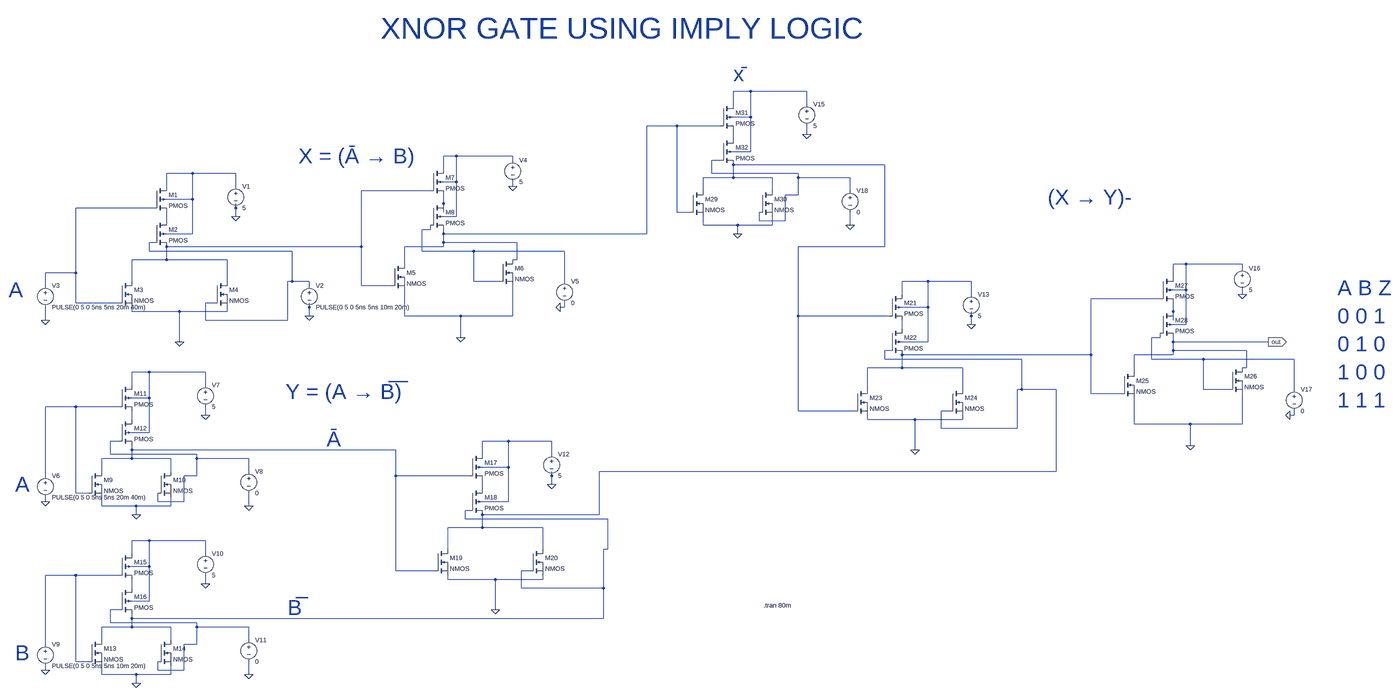
[diagram p0: schematic originalxnorgateimply.asc, whole sheet]
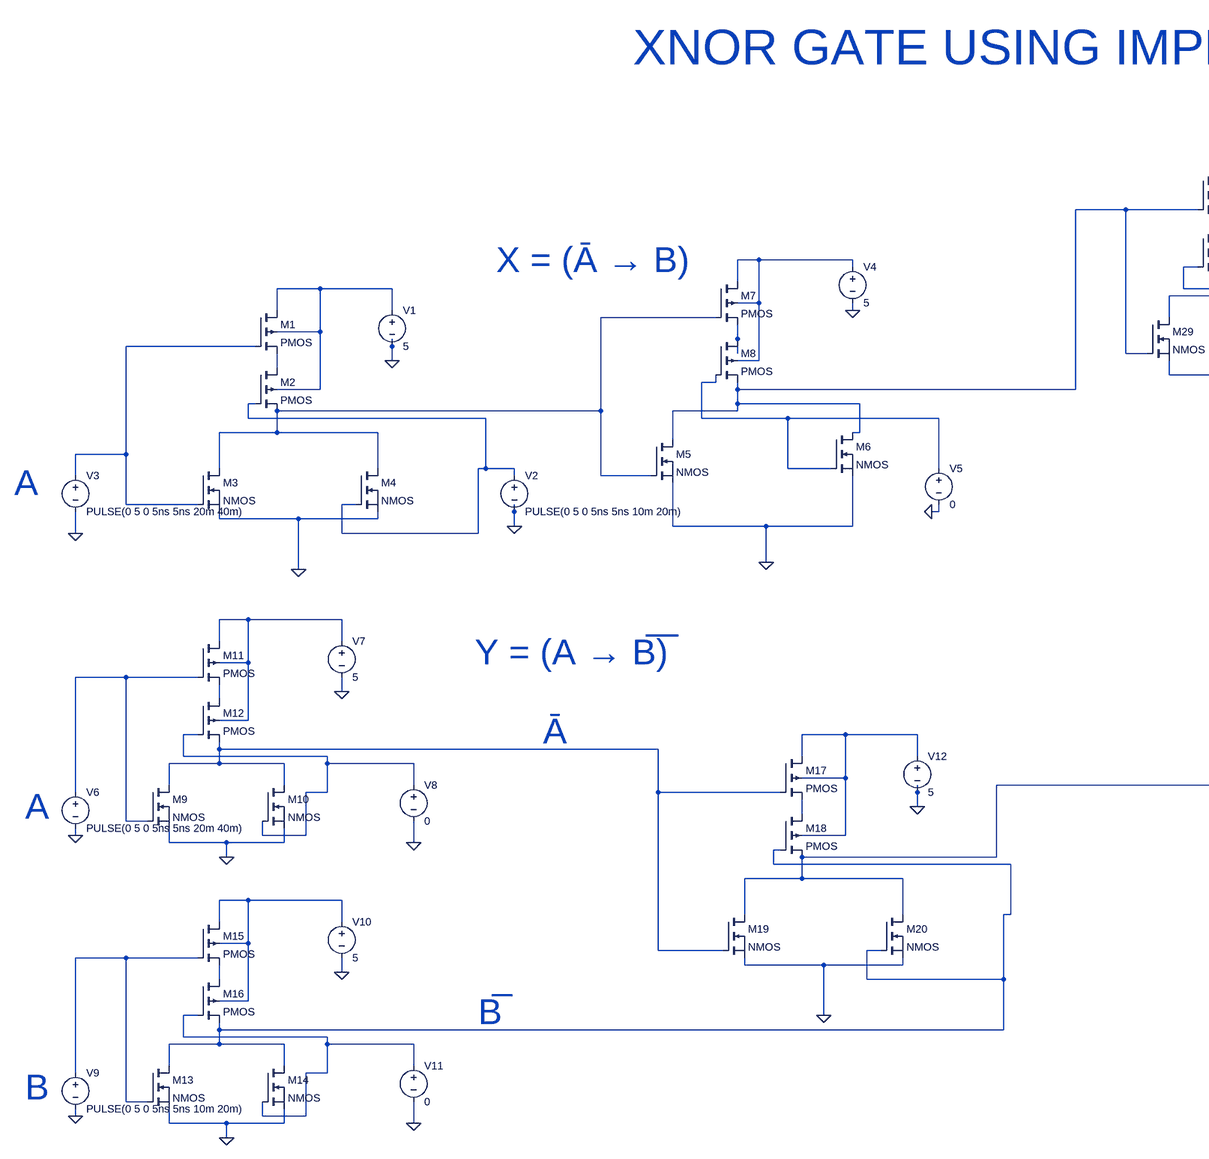
[diagram p1: schematic originalxnorgateimply.asc, part, row 1 of 1, column 1 of 2]
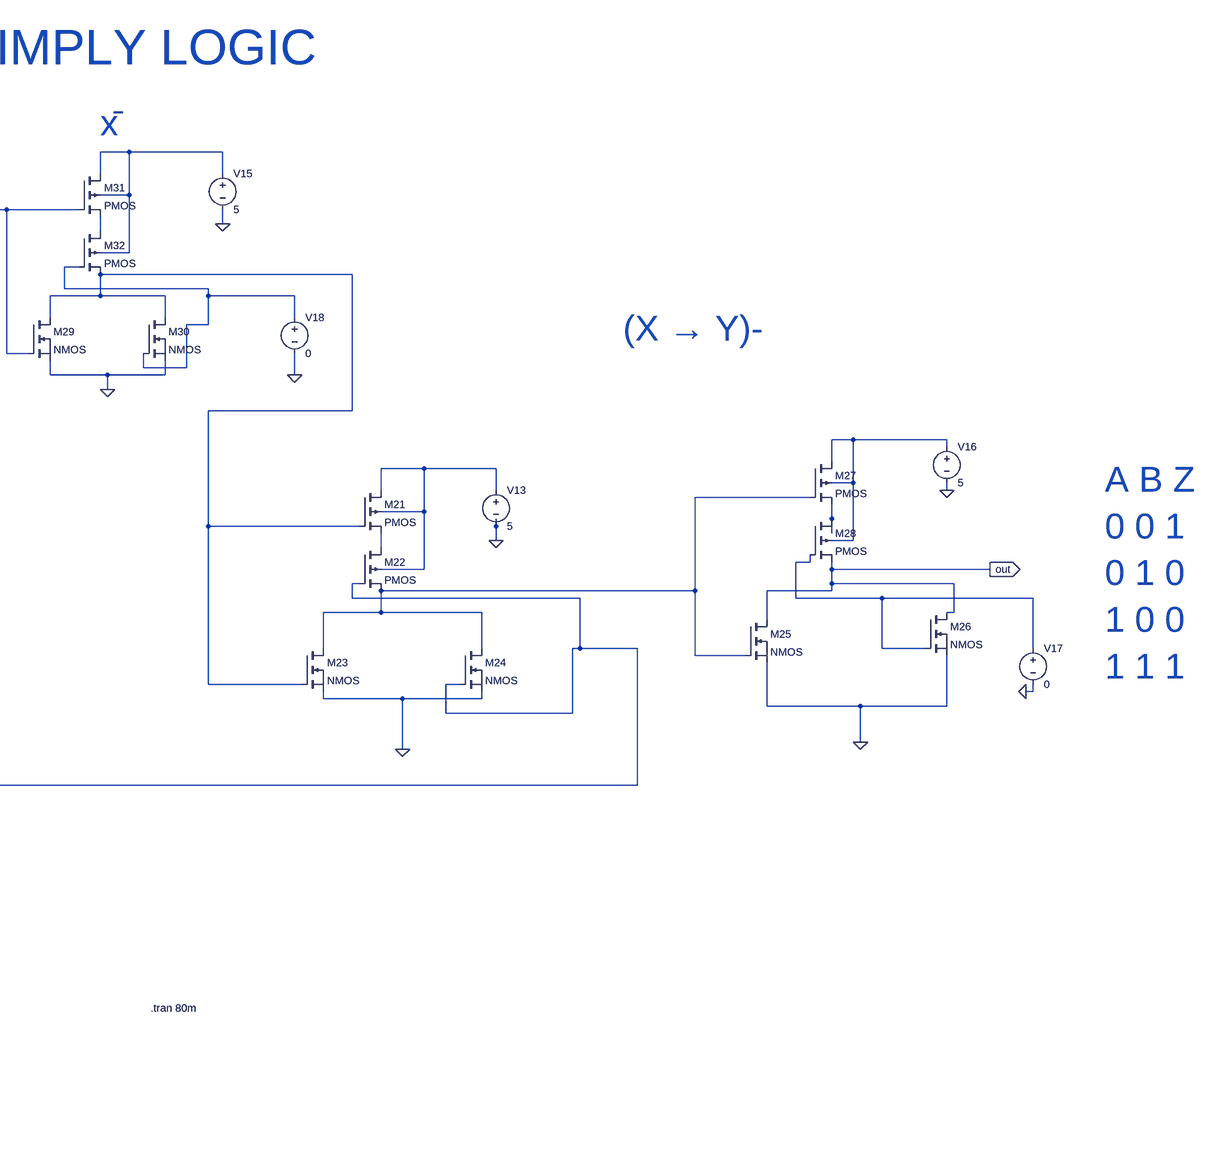
[diagram p2: schematic originalxnorgateimply.asc, part, row 1 of 1, column 2 of 2]
originalxnorgateimply.asc, the LTspice schematic file:
Version 4
SHEET 1 4060 1688
WIRE 1664 -592 1600 -592
WIRE 1872 -592 1664 -592
WIRE 1600 -544 1600 -592
WIRE 1872 -544 1872 -592
WIRE 1664 -496 1664 -592
WIRE 1664 -496 1600 -496
WIRE 1392 -464 1280 -464
WIRE 1552 -464 1392 -464
WIRE 1872 -432 1872 -464
WIRE 1600 -416 1600 -448
WIRE 1664 -368 1664 -496
WIRE 1664 -368 1600 -368
WIRE 576 -352 528 -352
WIRE 784 -352 576 -352
WIRE 784 -336 784 -352
WIRE 1552 -336 1520 -336
WIRE 2160 -320 1600 -320
WIRE 528 -304 528 -352
WIRE -400 -288 -496 -288
WIRE -240 -288 -400 -288
WIRE 1520 -288 1520 -336
WIRE 1840 -288 1520 -288
WIRE 1600 -272 1600 -320
WIRE 1600 -272 1488 -272
WIRE 1744 -272 1600 -272
WIRE 1840 -272 1840 -288
WIRE 2032 -272 1840 -272
WIRE 576 -256 576 -352
WIRE 576 -256 528 -256
WIRE -496 -240 -496 -288
WIRE -240 -240 -240 -288
WIRE 784 -240 784 -256
WIRE 480 -224 224 -224
WIRE 1488 -224 1488 -272
WIRE 1744 -224 1744 -272
WIRE 2032 -224 2032 -272
WIRE 1840 -208 1840 -272
WIRE 1840 -208 1792 -208
WIRE -400 -192 -400 -288
WIRE -400 -192 -496 -192
WIRE 528 -176 528 -208
WIRE -544 -160 -832 -160
WIRE -240 -160 -240 -176
WIRE 528 -144 528 -176
WIRE 1392 -144 1392 -464
WIRE 1440 -144 1392 -144
WIRE -240 -128 -240 -160
WIRE 576 -128 576 -256
WIRE 576 -128 528 -128
WIRE -496 -112 -496 -144
WIRE 1696 -112 1696 -144
WIRE 1792 -112 1792 -208
WIRE 1792 -112 1696 -112
WIRE 1488 -96 1488 -128
WIRE 1616 -96 1488 -96
WIRE 1744 -96 1744 -128
WIRE 1744 -96 1616 -96
WIRE 2032 -96 2032 -144
WIRE 480 -80 480 -96
WIRE 480 -80 448 -80
WIRE -400 -64 -400 -192
WIRE -400 -64 -496 -64
WIRE 528 -64 528 -80
WIRE 1280 -64 1280 -464
WIRE 1280 -64 528 -64
WIRE 1616 -64 1616 -96
WIRE -544 -32 -560 -32
WIRE 528 -32 528 -64
WIRE 800 -32 528 -32
WIRE 224 -16 224 -224
WIRE 224 -16 -496 -16
WIRE 528 -16 528 -32
WIRE 528 -16 384 -16
WIRE 2160 -16 2160 -320
WIRE 2160 -16 1840 -16
WIRE -560 0 -560 -32
WIRE -32 0 -560 0
WIRE 448 0 448 -80
WIRE 640 0 448 0
WIRE 976 0 640 0
WIRE -496 32 -496 -16
WIRE -496 32 -624 32
WIRE -272 32 -496 32
WIRE 800 32 800 -32
WIRE 800 32 784 32
WIRE 384 48 384 -16
WIRE 3296 48 3248 48
WIRE 3504 48 3296 48
WIRE 3504 64 3504 48
WIRE -832 80 -832 -160
WIRE -832 80 -944 80
WIRE 3248 96 3248 48
WIRE -624 112 -624 32
WIRE -272 112 -272 32
WIRE -32 112 -32 0
WIRE -32 112 -48 112
WIRE 32 112 -32 112
WIRE 640 112 640 0
WIRE 736 112 640 112
WIRE 976 112 976 0
WIRE 2320 112 2224 112
WIRE 2480 112 2320 112
WIRE -944 128 -944 80
WIRE 32 128 32 112
WIRE 224 128 224 -16
WIRE 336 128 224 128
WIRE 3296 144 3296 48
WIRE 3296 144 3248 144
WIRE 2224 160 2224 112
WIRE 2480 160 2480 112
WIRE 3504 160 3504 144
WIRE 3200 176 2944 176
WIRE -832 192 -832 80
WIRE -672 192 -832 192
WIRE -320 192 -352 192
WIRE 32 208 32 192
WIRE 976 208 976 192
WIRE 976 208 960 208
WIRE 2320 208 2320 112
WIRE 2320 208 2224 208
WIRE -624 224 -624 208
WIRE -448 224 -624 224
WIRE -272 224 -272 208
WIRE -272 224 -448 224
WIRE 3248 224 3248 192
WIRE 32 240 32 208
WIRE 384 240 384 144
WIRE 592 240 384 240
WIRE 784 240 784 128
WIRE 784 240 592 240
WIRE 1840 240 1840 -16
WIRE 2176 240 1840 240
WIRE 2480 240 2480 224
WIRE -944 256 -944 208
WIRE -352 256 -352 192
WIRE -48 256 -48 112
WIRE -48 256 -352 256
WIRE 3248 256 3248 224
WIRE 2480 272 2480 240
WIRE 3296 272 3296 144
WIRE 3296 272 3248 272
WIRE 2224 288 2224 256
WIRE 592 320 592 240
WIRE 3200 320 3200 304
WIRE 3200 320 3168 320
WIRE -448 336 -448 224
WIRE 2320 336 2320 208
WIRE 2320 336 2224 336
WIRE 3248 336 3248 320
WIRE 3600 336 3248 336
WIRE 2176 368 2160 368
WIRE 3248 368 3248 336
WIRE 3520 368 3248 368
WIRE 2944 384 2944 176
WIRE 2944 384 2224 384
WIRE 3248 384 3248 368
WIRE 3248 384 3104 384
WIRE 2160 400 2160 368
WIRE 2688 400 2160 400
WIRE 3168 400 3168 320
WIRE 3360 400 3168 400
WIRE 3696 400 3360 400
WIRE 2224 432 2224 384
WIRE 2224 432 2096 432
WIRE 2448 432 2224 432
WIRE 3520 432 3520 368
WIRE 3520 432 3504 432
WIRE -560 448 -624 448
WIRE -352 448 -560 448
WIRE 3104 448 3104 384
WIRE -624 496 -624 448
WIRE -352 496 -352 448
WIRE 2096 512 2096 432
WIRE 2448 512 2448 432
WIRE 2688 512 2688 400
WIRE 2688 512 2672 512
WIRE 2816 512 2688 512
WIRE 3360 512 3360 400
WIRE 3456 512 3360 512
WIRE 3696 512 3696 400
WIRE 2944 528 2944 384
WIRE 3056 528 2944 528
WIRE -560 544 -560 448
WIRE -560 544 -624 544
WIRE -832 576 -944 576
WIRE -672 576 -832 576
WIRE 1840 592 1840 240
WIRE 2048 592 1840 592
WIRE 2400 592 2368 592
WIRE -352 608 -352 576
WIRE 3696 608 3696 592
WIRE 3696 608 3680 608
WIRE -624 624 -624 592
WIRE 2096 624 2096 608
WIRE 2272 624 2096 624
WIRE 2448 624 2448 608
WIRE 2448 624 2272 624
WIRE 3104 640 3104 544
WIRE 3312 640 3104 640
WIRE 3504 640 3504 528
WIRE 3504 640 3312 640
WIRE 2368 656 2368 592
WIRE 2672 656 2672 512
WIRE 2672 656 2368 656
WIRE -560 672 -560 544
WIRE -560 672 -624 672
WIRE -672 704 -704 704
WIRE 768 704 672 704
WIRE 928 704 768 704
WIRE 3312 720 3312 640
WIRE -624 736 -624 720
WIRE 352 736 -624 736
WIRE 2272 736 2272 624
WIRE -704 752 -704 704
WIRE -384 752 -704 752
WIRE 672 752 672 704
WIRE 928 752 928 704
WIRE -624 768 -624 736
WIRE -624 768 -736 768
WIRE -480 768 -624 768
WIRE -384 768 -384 752
WIRE -192 768 -384 768
WIRE 768 800 768 704
WIRE 768 800 672 800
WIRE -736 816 -736 768
WIRE -480 816 -480 768
WIRE -192 816 -192 768
WIRE 2816 816 2816 512
WIRE 2816 816 1104 816
WIRE -944 832 -944 576
WIRE -384 832 -384 768
WIRE -384 832 -432 832
WIRE 352 832 352 736
WIRE 624 832 352 832
WIRE 928 832 928 816
WIRE 928 864 928 832
WIRE 672 880 672 848
WIRE -832 896 -832 576
WIRE -784 896 -832 896
WIRE -944 928 -944 912
WIRE -528 928 -528 896
WIRE -432 928 -432 832
WIRE -432 928 -528 928
WIRE 768 928 768 800
WIRE 768 928 672 928
WIRE -736 944 -736 912
WIRE -608 944 -736 944
WIRE -480 944 -480 912
WIRE -480 944 -608 944
WIRE -192 944 -192 896
WIRE 624 960 608 960
WIRE -608 976 -608 944
WIRE 1104 976 1104 816
WIRE 1104 976 672 976
WIRE 608 992 608 960
WIRE 1136 992 608 992
WIRE 672 1024 672 976
WIRE 672 1024 544 1024
WIRE 896 1024 672 1024
WIRE -560 1072 -624 1072
WIRE -352 1072 -560 1072
WIRE 544 1104 544 1024
WIRE 896 1104 896 1024
WIRE 1136 1104 1136 992
WIRE 1136 1104 1120 1104
WIRE -624 1120 -624 1072
WIRE -352 1120 -352 1072
WIRE -560 1168 -560 1072
WIRE -560 1168 -624 1168
WIRE 352 1184 352 832
WIRE 496 1184 352 1184
WIRE 848 1184 816 1184
WIRE -832 1200 -944 1200
WIRE -672 1200 -832 1200
WIRE 544 1216 544 1200
WIRE 720 1216 544 1216
WIRE 896 1216 896 1200
WIRE 896 1216 720 1216
WIRE -352 1232 -352 1200
WIRE -624 1248 -624 1216
WIRE 816 1248 816 1184
WIRE 1120 1248 1120 1104
WIRE 1120 1248 816 1248
WIRE -560 1296 -560 1168
WIRE -560 1296 -624 1296
WIRE -672 1328 -704 1328
WIRE 720 1328 720 1216
WIRE -624 1360 -624 1344
WIRE 1120 1360 1120 1248
WIRE 1120 1360 -624 1360
WIRE -704 1376 -704 1328
WIRE -384 1376 -704 1376
WIRE -624 1392 -624 1360
WIRE -624 1392 -736 1392
WIRE -480 1392 -624 1392
WIRE -384 1392 -384 1376
WIRE -192 1392 -384 1392
WIRE -736 1440 -736 1392
WIRE -480 1440 -480 1392
WIRE -192 1440 -192 1392
WIRE -944 1456 -944 1200
WIRE -384 1456 -384 1392
WIRE -384 1456 -432 1456
WIRE -832 1520 -832 1200
WIRE -784 1520 -832 1520
WIRE -944 1552 -944 1536
WIRE -528 1552 -528 1520
WIRE -432 1552 -432 1456
WIRE -432 1552 -528 1552
WIRE -736 1568 -736 1536
WIRE -608 1568 -736 1568
WIRE -480 1568 -480 1536
WIRE -480 1568 -608 1568
WIRE -192 1568 -192 1520
WIRE -608 1600 -608 1568
FLAG -944 256 0
FLAG -448 336 0
FLAG 32 240 0
FLAG -240 -128 0
FLAG 784 -240 0
FLAG 592 320 0
FLAG 960 208 0
FLAG -352 608 0
FLAG -608 976 0
FLAG -944 928 0
FLAG -192 944 0
FLAG -352 1232 0
FLAG -608 1600 0
FLAG -944 1552 0
FLAG -192 1568 0
FLAG 720 1328 0
FLAG 928 864 0
FLAG 2272 736 0
FLAG 2480 272 0
FLAG 3504 160 0
FLAG 3312 720 0
FLAG 3680 608 0
FLAG 3600 336 out
IOPIN 3600 336 Out
FLAG 1872 -432 0
FLAG 1616 -64 0
FLAG 2032 -96 0
SYMBOL pmos4 -544 -240 R0
SYMATTR InstName M1
SYMBOL pmos4 -544 -112 R0
SYMATTR InstName M2
SYMBOL nmos -672 112 R0
SYMATTR InstName M3
SYMBOL nmos -320 112 R0
SYMATTR InstName M4
SYMBOL voltage -240 -256 R0
WINDOW 123 0 0 Left 0
WINDOW 39 0 0 Left 0
SYMATTR InstName V1
SYMATTR Value 5
SYMBOL voltage 32 112 R0
WINDOW 123 0 0 Left 0
WINDOW 39 0 0 Left 0
SYMATTR InstName V2
SYMATTR Value PULSE(0 5 0 5ns 5ns 10m 20m)
SYMBOL voltage -944 112 R0
WINDOW 123 0 0 Left 0
WINDOW 39 0 0 Left 0
SYMATTR InstName V3
SYMATTR Value PULSE(0 5 0 5ns 5ns 20m 40m)
SYMBOL nmos 336 48 R0
SYMATTR InstName M5
SYMBOL nmos 736 32 R0
SYMATTR InstName M6
SYMBOL voltage 784 -352 R0
WINDOW 123 0 0 Left 0
WINDOW 39 0 0 Left 0
SYMATTR InstName V4
SYMATTR Value 5
SYMBOL voltage 976 96 R0
WINDOW 123 0 0 Left 0
WINDOW 39 0 0 Left 0
SYMATTR InstName V5
SYMATTR Value 0
SYMBOL pmos4 480 -304 R0
SYMATTR InstName M7
SYMBOL pmos4 480 -176 R0
SYMATTR InstName M8
SYMBOL nmos -784 816 R0
SYMATTR InstName M9
SYMBOL voltage -944 816 R0
WINDOW 123 0 0 Left 0
WINDOW 39 0 0 Left 0
SYMATTR InstName V6
SYMATTR Value PULSE(0 5 0 5ns 5ns 20m 40m)
SYMBOL voltage -352 480 R0
WINDOW 123 0 0 Left 0
WINDOW 39 0 0 Left 0
SYMATTR InstName V7
SYMATTR Value 5
SYMBOL voltage -192 800 R0
WINDOW 123 0 0 Left 0
WINDOW 39 0 0 Left 0
SYMATTR InstName V8
SYMATTR Value 0
SYMBOL nmos -528 816 R0
SYMATTR InstName M10
SYMBOL pmos4 -672 496 R0
SYMATTR InstName M11
SYMBOL pmos4 -672 624 R0
SYMATTR InstName M12
SYMBOL nmos -784 1440 R0
SYMATTR InstName M13
SYMBOL voltage -944 1440 R0
WINDOW 123 0 0 Left 0
WINDOW 39 0 0 Left 0
SYMATTR InstName V9
SYMATTR Value PULSE(0 5 0 5ns 5ns 10m 20m)
SYMBOL voltage -352 1104 R0
WINDOW 123 0 0 Left 0
WINDOW 39 0 0 Left 0
SYMATTR InstName V10
SYMATTR Value 5
SYMBOL voltage -192 1424 R0
WINDOW 123 0 0 Left 0
WINDOW 39 0 0 Left 0
SYMATTR InstName V11
SYMATTR Value 0
SYMBOL nmos -528 1440 R0
SYMATTR InstName M14
SYMBOL pmos4 -672 1120 R0
SYMATTR InstName M15
SYMBOL pmos4 -672 1248 R0
SYMATTR InstName M16
SYMBOL pmos4 624 752 R0
SYMATTR InstName M17
SYMBOL pmos4 624 880 R0
SYMATTR InstName M18
SYMBOL nmos 496 1104 R0
SYMATTR InstName M19
SYMBOL nmos 848 1104 R0
SYMATTR InstName M20
SYMBOL voltage 928 736 R0
WINDOW 123 0 0 Left 0
WINDOW 39 0 0 Left 0
SYMATTR InstName V12
SYMATTR Value 5
SYMBOL pmos4 2176 160 R0
SYMATTR InstName M21
SYMBOL pmos4 2176 288 R0
SYMATTR InstName M22
SYMBOL nmos 2048 512 R0
SYMATTR InstName M23
SYMBOL nmos 2400 512 R0
SYMATTR InstName M24
SYMBOL voltage 2480 144 R0
WINDOW 123 0 0 Left 0
WINDOW 39 0 0 Left 0
SYMATTR InstName V13
SYMATTR Value 5
SYMBOL nmos 3056 448 R0
SYMATTR InstName M25
SYMBOL nmos 3456 432 R0
SYMATTR InstName M26
SYMBOL voltage 3504 48 R0
WINDOW 123 0 0 Left 0
WINDOW 39 0 0 Left 0
SYMATTR InstName V16
SYMATTR Value 5
SYMBOL voltage 3696 496 R0
WINDOW 123 0 0 Left 0
WINDOW 39 0 0 Left 0
SYMATTR InstName V17
SYMATTR Value 0
SYMBOL pmos4 3200 96 R0
SYMATTR InstName M27
SYMBOL pmos4 3200 224 R0
SYMATTR InstName M28
SYMBOL nmos 1440 -224 R0
SYMATTR InstName M29
SYMBOL voltage 1872 -560 R0
WINDOW 123 0 0 Left 0
WINDOW 39 0 0 Left 0
SYMATTR InstName V15
SYMATTR Value 5
SYMBOL voltage 2032 -240 R0
WINDOW 123 0 0 Left 0
WINDOW 39 0 0 Left 0
SYMATTR InstName V18
SYMATTR Value 0
SYMBOL nmos 1696 -224 R0
SYMATTR InstName M30
SYMBOL pmos4 1552 -544 R0
SYMATTR InstName M31
SYMBOL pmos4 1552 -416 R0
SYMATTR InstName M32
TEXT -8 -352 Left 6 ;X = (Ā → B)
TEXT 1712 1312 Left 2 !.tran 80m
TEXT 2784 -200 Left 6 ;(X → Y)-
TEXT 1600 -656 Left 6 ;x̄
TEXT -1080 144 Left 6 ;A
TEXT -1056 1488 Left 6 ;B
TEXT -1056 864 Left 6 ;A
TEXT -48 1320 Left 6 ;B̅
TEXT 96 696 Left 6 ;Ā
TEXT -56 520 Left 6 ;Y = (A → B̅)̅
TEXT 296 -832 Left 7 ;XNOR GATE USING IMPLY LOGIC
TEXT 3856 136 Left 6 ;A B Z\n0 0 1\n0 1 0\n1 0 0\n1 1 1

The netlist it stands for:
* originalxnorgateimply.asc
M1 N007 N010 N011 N007 PMOS
M2 N011 N013 N008 N007 PMOS
M3 N008 N010 0 0 NMOS
M4 N008 N013 0 0 NMOS
V1 N007 0 5
V2 N013 0 PULSE(0 5 0 5ns 5ns 10m 20m)
V3 N010 0 PULSE(0 5 0 5ns 5ns 20m 40m)
M5 N002 N008 0 0 NMOS
M6 N002 N012 0 0 NMOS
V4 N004 0 5
V5 N012 0 0
M7 N004 N008 N009 N004 PMOS
M8 N009 N012 N002 N004 PMOS
M9 N026 N022 0 0 NMOS
V6 N022 0 PULSE(0 5 0 5ns 5ns 20m 40m)
V7 N021 0 5
V8 N024 0 0
M10 N026 N024 0 0 NMOS
M11 N021 N022 N023 N021 PMOS
M12 N023 N024 N026 N021 PMOS
M13 N028 N030 0 0 NMOS
V9 N030 0 PULSE(0 5 0 5ns 5ns 10m 20m)
V10 N029 0 5
V11 N032 0 0
M14 N028 N032 0 0 NMOS
M15 N029 N030 N031 N029 PMOS
M16 N031 N032 N028 N029 PMOS
M17 N025 N026 N027 N025 PMOS
M18 N027 N028 N020 N025 PMOS
M19 N020 N026 0 0 NMOS
M20 N020 N028 0 0 NMOS
V12 N025 0 5
M21 N015 N006 N018 N015 PMOS
M22 N018 N020 N016 N015 PMOS
M23 N016 N006 0 0 NMOS
M24 N016 N020 0 0 NMOS
V13 N015 0 5
M25 out N016 0 0 NMOS
M26 out N019 0 0 NMOS
V16 N014 0 5
V17 N019 0 0
M27 N014 N016 N017 N014 PMOS
M28 N017 N019 out N014 PMOS
M29 N006 N002 0 0 NMOS
V15 N001 0 5
V18 N005 0 0
M30 N006 N005 0 0 NMOS
M31 N001 N002 N003 N001 PMOS
M32 N003 N005 N006 N001 PMOS
.model NMOS NMOS
.model PMOS PMOS
.lib standard.mos
* X = (Ā → B)
.tran 80m
* (X → Y)-
* x̄
* A
* B
* A
* B̅
* Ā
* Y = (A → B̅)̅
* XNOR GATE USING IMPLY LOGIC
* A B Z
* 0 0 1
* 0 1 0
* 1 0 0
* 1 1 1
.backanno
.end